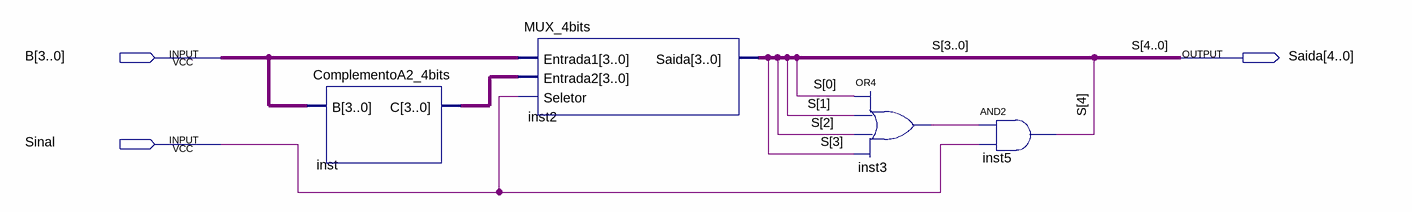
[diagram p0: schematic sheet]
// Quartus schematic Modulo_Cmp2.bdf as structural Verilog: 4 symbols, 3 pins
module Modulo_Cmp2 (
  input  [3:0] B,
  input  Sinal,
  output [4:0] Saida
);

  wire inst3_out;
  wire [3:0] inst_c;

  ComplementoA2_4bits inst (.B(B), .C(inst_c));
  MUX_4bits inst2 (.Entrada1(B), .Entrada2(inst_c), .Seletor(Sinal), .Saida(Saida[3:0]));
  or inst3 (inst3_out, Saida[0], Saida[1], Saida[2], Saida[3]);
  and inst5 (Saida[4], inst3_out, Sinal);

  // Other names for the same wires on the sheet: S[4:0] = Saida
endmodule
